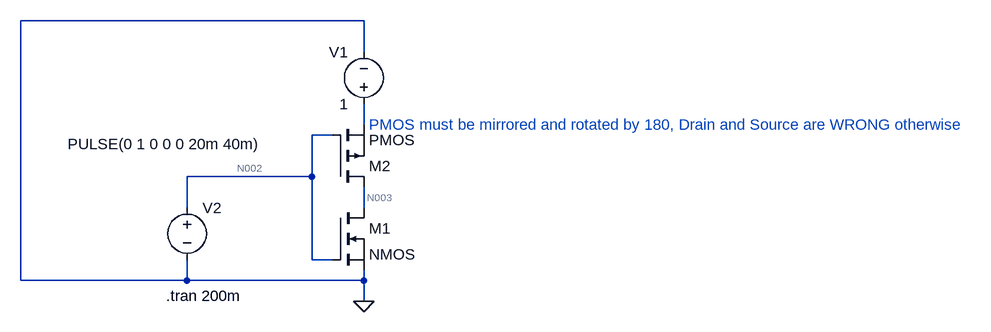
[diagram p0: schematic Inverter.asc]
Inverter.asc, the LTspice schematic file:
Version 4.1
SHEET 1 1252 680
WIRE 256 -64 -272 -64
WIRE 256 -16 256 -64
WIRE 256 96 256 64
WIRE 208 112 176 112
WIRE 176 176 176 112
WIRE 176 176 -16 176
WIRE -16 224 -16 176
WIRE 256 224 256 192
WIRE 176 304 176 176
WIRE 208 304 176 304
WIRE -272 336 -272 -64
WIRE -16 336 -16 304
WIRE -16 336 -272 336
WIRE 256 336 256 320
WIRE 256 336 -16 336
WIRE 256 368 256 336
FLAG 256 368 0
SYMBOL nmos 208 224 R0
SYMATTR InstName M1
SYMBOL pmos 208 192 M180
SYMATTR InstName M2
SYMBOL voltage 256 80 R180
WINDOW 0 24 96 Left 2
WINDOW 3 24 16 Left 2
SYMATTR InstName V1
SYMATTR Value 1
SYMBOL voltage -16 208 R0
WINDOW 3 -184 -82 Left 2
WINDOW 123 0 0 Left 0
WINDOW 39 0 0 Left 0
SYMATTR InstName V2
SYMATTR Value PULSE(0 1 0 0 0 20m 40m)
TEXT -48 360 Left 2 !.tran 200m
TEXT 264 96 Left 2 ;PMOS must be mirrored and rotated by 180, Drain and Source are WRONG otherwise

The netlist it stands for:
* Inverter.asc
M1 N003 N002 0 0 NMOS
M2 N003 N002 N001 N001 PMOS
V1 N001 0 1
V2 N002 0 PULSE(0 1 0 0 0 20m 40m)
.model NMOS NMOS
.model PMOS PMOS
.lib standard.mos
.tran 200m
* PMOS must be mirrored and rotated by 180, Drain and Source are WRONG otherwise
.backanno
.end

* Results of the author's LTspice run, read from the files saved beside the schematic
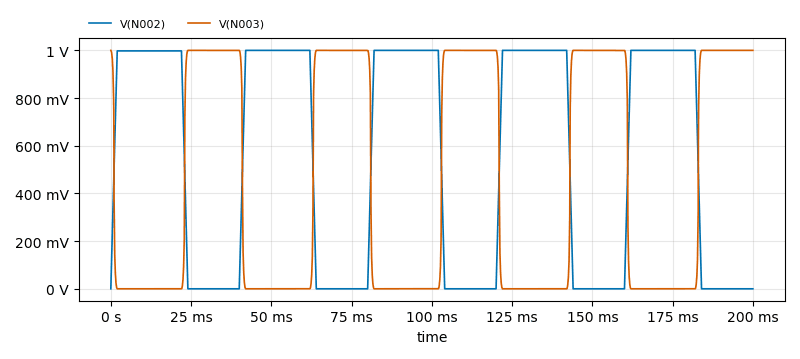
[diagram p1: Transient Analysis of Inverter.asc, plotted from the saved traces]
* Transient Analysis, 1 run:
*   V(N002): min 0 V, max 1 V, average 549.8 mV, rms 730.1 mV, last 0 V
*   V(N003): min 0 V, max 1 V, average 449.8 mV, rms 665.6 mV, last 1 V